# EAGLE design RH012.1 (EAGLE 7.1.0)
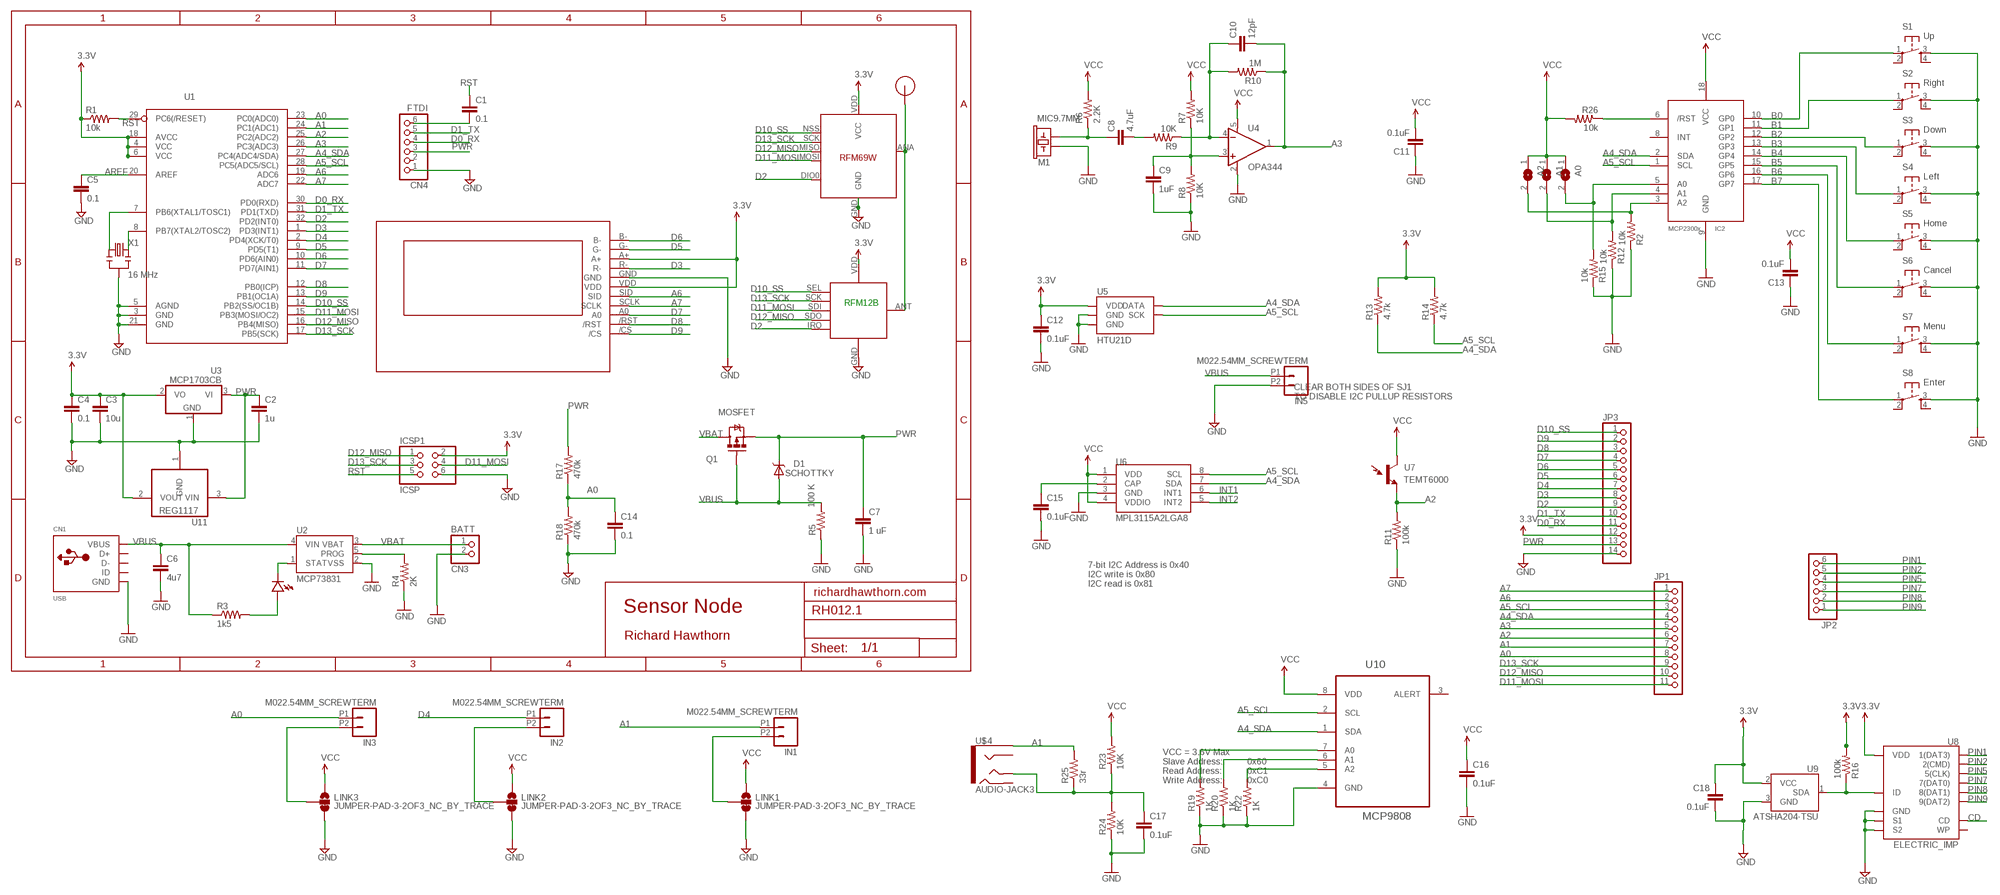
[diagram p0: schematic, sheet 1]

## Parts
A0  SJ  [SJ]
A1  SJ  [SJ]
A2  SJ  [SJ]
C1  0.1  CAP0603-CAP  [0603-CAP]
C2  1u  CAP0603-CAP  [0603-CAP]
C3  10u  CAP0805-CAP  [0805-CAP]
C4  0.1  CAP0603-CAP  [0603-CAP]
C5  0.1  CAP0603-CAP  [0603-CAP]
C6  4u7  CAP0603-CAP  [0603-CAP]
C7  1 uF  CAP0805  [0805]
C8  4.7uF  CAP0805  [0805]
C9  1uF  CAP0805  [0805]
C10  12pF  CAP0805  [0805]
C11  0.1uF  CAP0805  [0805]
C12  0.1uF  CAP0805  [0805]
C13  0.1uF  CAP0805  [0805]
C14  0.1  CAP0603-CAP  [0603-CAP]
C15  0.1uF  CAP0805  [0805]
C16  0.1uF  CAP0603-CAP  [0603-CAP]
C17  0.1uF  CAP0603-CAP  [0603-CAP]
C18  0.1uF  CAP0805  [0805]
CN1  USB  USBMINIB  [USB-MINIB]
CN3  BATT  JST_2PIN-SMT-RA  [JST-PH-2-SMT-RA]
CN4  FTDI  PINHD-1X6  [1X06]
D1  SCHOTTKY  DIODE-SCHOTTKY_  [SMA-DIODE]
IC2  MCP2300X/SO  [SO18W]
ICSP1  ICSP  PINHD-2X3  [2X03]
IN1  M022.54MM_SCREWTERM  [1X02_2.54_SCREWTERM]
IN2  M022.54MM_SCREWTERM  [1X02_2.54_SCREWTERM]
IN3  M022.54MM_SCREWTERM  [1X02_2.54_SCREWTERM]
IN5  M022.54MM_SCREWTERM  [1X02_2.54_SCREWTERM]
JP1  PINHD-1X11  [1X11]
JP2  PINHD-1X6  [1X06]
JP3  PINHD-1X14  [1X14]
LED1  LED0603  [0603-LED]
LINK1  JUMPER-PAD-3-2OF3_NC_BY_TRACE  [PAD-JUMPER-3-2OF3_NC_BY_TRACE_YES_SILK_FULL_BOX]
LINK2  JUMPER-PAD-3-2OF3_NC_BY_TRACE  [PAD-JUMPER-3-2OF3_NC_BY_TRACE_YES_SILK_FULL_BOX]
LINK3  JUMPER-PAD-3-2OF3_NC_BY_TRACE  [PAD-JUMPER-3-2OF3_NC_BY_TRACE_YES_SILK_FULL_BOX]
M1  MIC9.7MM  [MIC-9.7MM]
Q1  MOSFET  MOSFET-PCHANNELSMD  [SOT23-3]
R1  10k  RESISTOR0603-RES  [0603-RES]
R2  10k  R-US_R0805  [R0805]
R3  1k5  RESISTOR0603-RES  [0603-RES]
R4  2K  RESISTOR0603-RES  [0603-RES]
R5  100 K  RESISTOR0805-RES  [0805]
R6  2.2K  RESISTOR0805-RES  [0805]
R7  10K  RESISTOR0805-RES  [0805]
R8  10K  RESISTOR0805-RES  [0805]
R9  10K  RESISTOR0805-RES  [0805]
R10  1M  RESISTOR0805-RES  [0805]
R11  100k  RESISTOR0603-RES  [0603-RES]
R12  10k  R-US_R0805  [R0805]
R13  4.7k  RESISTOR0805-RES  [0805]
R14  4.7k  RESISTOR0805-RES  [0805]
R15  10k  R-US_R0805  [R0805]
R16  100k  RESISTOR0805-RES  [0805]
R17  470k  RESISTOR0603-RES  [0603-RES]
R18  470k  RESISTOR0603-RES  [0603-RES]
R19  1K  RESISTOR0603-RES  [0603-RES]
R20  1K  RESISTOR0603-RES  [0603-RES]
R22  1K  RESISTOR0603-RES  [0603-RES]
R23  10K  RESISTOR0603-RES  [0603-RES]
R24  10K  RESISTOR0603-RES  [0603-RES]
R25  33r  RESISTOR0603-RES  [0603-RES]
R26  10k  R-US_R0805  [R0805]
RF1  RFM12B  RFM12B_MINPADS  [RFM12B-MINPADS]
RF2  RFM69  [RFM69W-MINPADS]
S1  Up  DTS-6  [DTS-6]
S2  Right  DTS-6  [DTS-6]
S3  Down  DTS-6  [DTS-6]
S4  Left  DTS-6  [DTS-6]
S5  Home  DTS-6  [DTS-6]
S6  Cancel  DTS-6  [DTS-6]
S7  Menu  DTS-6  [DTS-6]
S8  Enter  DTS-6  [DTS-6]
U1  ATMega-328  ATMEGA168/328TQFP32  [TQFP32-08]
U2  MCP73831  [SOT23-5]
U3  MCP1703CB  [SOT23]
U4  OPA344  [SOT23-5]
U5  HTU21D  HTU21DSMD  [HTU21D]
U6  MPL3115A2LGA8  [LGA8]
U7  TEMT6000  [TEMT6000-SEN]
U8  ELECTRIC_IMP  [SD_MMC_SOCKET]
U9  ATSHA204-TSU  [SOT23-3]
U10  MCP9808  MCP9808-E/MS  [SOP65P490X110-8N]
U11  REG1117  [SOT223]
U$1  RFM12B_ANTENNA  [RFM12B-ANTENNA]
U$2  ST7565LCD  [ST7565LCD]
U$4  AUDIO-JACK3  [AUDIO-JACK-TRRS-SMD]
X1  16 MHz  RESONATORSMD  [RESONATOR-SMD]

## Nets
3.3V: A0.1 A1.1 A2.1 C3.1 C4.1 C11.2 C12.1 C13.2 C16.1 C18.1 IC2.18(VCC) ICSP1.2 JP3.12 LINK1.1 LINK2.1 LINK3.1 R1.1 R6.2 R7.2 R13.2 R14.2 R16.2 R23.2 R26.2 RF1.VDD RF2.VDD(VCC) U1.4(VCC) U1.6(VCC) U1.18(AVCC) U3.2(VO) U4.5(V+) U5.VDD U6.1(VDD) U6.4(VDDIO) U7.COLLECTOR(C1) U8.4(VDD) U9.2(VCC) U10.8(VDD) U11.2(VOUT) ; supply symbol labelled VCC
A0: C14.1 IN3.P1 JP1.8 R17.1 R18.2 U1.23(PC0(ADC0))
A1: IN1.P1 JP1.7 R25.2 U1.24(PC1(ADC1)) U$4.EARTH
A2: JP1.6 R11.2 U1.25(PC2(ADC2)) U7.EMITTER(E1)
A3: C10.2 JP1.5 R10.1 U1.26(PC3(ADC3)) U4.1(OUT)
A4_SDA: IC2.2(SDA) JP1.4 R13.1 U1.27(PC4(ADC4/SDA)) U5.DATA U6.7(SDA) U10.1(SDA)
A5_SCL: IC2.1(SCL) JP1.3 R14.1 U1.28(PC5(ADC5/SCL)) U5.SCK U6.8(SCL) U10.2(SCL)
A6: JP1.2 U1.19(ADC6) U$2.SID
A7: JP1.1 U1.22(ADC7) U$2.SCLK
AREF: C5.1 U1.20(AREF)
B0: IC2.10(GP0) S1.1
B1: IC2.11(GP1) S2.1
B2: IC2.12(GP2) S3.1
B3: IC2.13(GP3) S4.1
B4: IC2.14(GP4) S5.1
B5: IC2.15(GP5) S6.1
B6: IC2.16(GP6) S7.1
B7: IC2.17(GP7) S8.1
CD: U8.CD
D0_RX: CN4.4 JP3.11 U1.30(PD0(RXD))
D1_TX: CN4.5 JP3.10 U1.31(PD1(TXD))
D2: JP3.9 RF1.IRQ RF2.DIO0 U1.32(PD2(INT0))
D3: JP3.8 U1.1(PD3(INT1)) U$2.R-
D4: IN2.P1 JP3.7 U1.2(PD4(XCK/T0))
D5: JP3.6 U1.9(PD5(T1)) U$2.G-
D6: JP3.5 U1.10(PD6(AIN0)) U$2.B-
D7: JP3.4 U1.11(PD7(AIN1)) U$2.A0
D8: JP3.3 U1.12(PB0(ICP)) U$2./RST
D9: JP3.2 U1.13(PB1(OC1A)) U$2./CS
D10_SS: JP3.1 RF1.SEL RF2.NSS(SEL) U1.14(PB2(SS/OC1B))
D11_MOSI: ICSP1.4 JP1.11 RF1.SDI(SDI/MOSI) RF2.MOSI U1.15(PB3(MOSI/OC2))
D12_MISO: ICSP1.1 JP1.10 RF1.SDO(SDO/MISO) RF2.MISO U1.16(PB4(MISO))
D13_SCK: ICSP1.3 JP1.9 RF1.SCK RF2.SCK U1.17(PB5(SCK))
GND [power]: C2.2 C3.2 C4.2 C5.2 C6.2 C7.2 C9.2 C11.1 C12.2 C13.1 C14.2 C15.2 C16.2 C17.2 C18.2 CN1.GND CN3.2 CN4.1 IC2.9(GND) ICSP1.6 IN5.P2 JP3.14 LINK1.3 LINK2.3 LINK3.3 M1.2 R2.1 R4.1 R5.1 R8.1 R11.1 R12.1 R15.1 R18.1 R19.1 R20.1 R22.1 R24.1 RF1.GND RF2.GND S1.3 S2.3 S3.3 S4.3 S5.3 S6.3 S7.3 S8.3 U1.3(GND) U1.5(AGND) U1.21(GND) U2.2(VSS) U3.1(GND) U4.2(V-) U5.7(GND) U5.GND U6.3(GND) U8.3(GND) U8.S1 U8.S2 U9.3(GND) U10.4(GND) U11.1(GND) U$2.GND X1.2
ID: R16.1 U8.6(ID) U9.1(SDA)
INT1: U6.6(INT1)
INT2: U6.5(INT2)
N$1: U1.7(PB6(XTAL1/TOSC1)) X1.1
N$2: A0.2 IC2.5(A0) R15.2
N$3: RF1.ANT RF2.ANA(ANT) U$1.P$1
N$4: LED1.PLUS R3.2
N$5: C8.1 M1.1 R6.1
N$6: C10.1 R9.1 R10.2 U4.4(-IN)
N$7: C8.2 R9.2
N$8: C9.1 R7.1 R8.2 U4.3(+IN)
N$9: C15.1 U6.2(CAP)
N$10: A1.2 IC2.4(A1) R12.2
N$11: A2.2 IC2.3(A2) R2.2
N$12: IC2.6(/RST) R26.1
N$13 [power]: IN1.P2 LINK1.2
N$14: C17.1 R23.1 R24.2 R25.1 U$4.TIP
N$15 [power]: IN2.P2 LINK2.2
N$16: R22.2 U10.5(A2)
N$17: R20.2 U10.6(A1)
N$18: R19.2 U10.7(A0)
N$19 [power]: IN3.P2 LINK3.2
N$20: C1.2 CN4.6
N$21: U1.8(PB7(XTAL2/TOSC2)) X1.3
PIN1: JP2.6 U8.1(1(DAT3))
PIN2: JP2.5 U8.2(2(CMD))
PIN5: JP2.4 U8.5(5(CLK))
PIN7: JP2.3 U8.7(7(DAT0))
PIN8: JP2.2 U8.8(8(DAT1))
PIN9: JP2.1 U8.9(9(DAT2))
PROG: R4.2 U2.5(PROG)
PWR [power]: C2.1 C7.1 CN4.3 D1.C JP3.13 Q1.2(S) R17.2 U3.3(VI) U11.3(VIN)
RST: C1.1 ICSP1.5 R1.2 U1.29(PC6(/RESET))
STAT: LED1.MINUS U2.1(STAT)
VBAT: CN3.1 Q1.3(D) U2.3(VBAT)
VBUS [power]: C6.1 CN1.VBUS D1.A IN5.P1 Q1.1(G) R3.1 R5.2 U2.4(VIN)
VCC: U$2.A+ U$2.VDD ; supply symbol labelled 3.3V
Unconnected: CN1.D+ CN1.D- CN1.ID CN4.2 IC2.8(INT) S1.2 S1.4 S2.2 S2.4 S3.2 S3.4 S4.2 S4.4 S5.2 S5.4 S6.2 S6.4 S7.2 S7.4 S8.2 S8.4 U8.WP U10.3(ALERT) U$4.RING1 U$4.RING2

## Notes on the sheet
- RFM12B
- CLEAR BOTH SIDES OF SJ1
- TO DISABLE I2C PULLUP RESISTORS
- 7-bit I2C Address is 0x40
- I2C write is 0x80
- I2C read is 0x81
- richardhawthorn.com
- Sensor Node
- Richard Hawthorn
- VCC = 3.6V Max
- Slave Address: | 0x60
- Read Address: | 0xC1
- Write Address: | 0xC0

## Library data of the parts
A0 A1 A2 = jumper:SJ: SMD solder JUMPER
C1-C5 C14 = LowPowerLab:CAP: Capacitor Standard 0603 ceramic capacitor, and 0.1" leaded capacitor.
C6 C8-C13 C15-C17 = SparkFun:CAP: Capacitor Standard 0603 ceramic capacitor, and 0.1" leaded capacitor.
C7 = SparkFun-Capacitors:CAP: Capacitor Standard 0603 ceramic capacitor, and 0.1" leaded capacitor.
C18 = SparkFun-Passives:CAP: Capacitor Standard 0603 ceramic capacitor, and 0.1" leaded capacitor.
CN1 = LowPowerLab:USB: USB Connectors USBMINIB - Surface Mount Female Mini-B USB Connector 4UConnector: 06564 By microbuilder.eu Thru-hole RA Female Mini-B USB Connector 4UConnector: 18732 By ladyada.net
CN3 = adafruit:JST_2PIN: JST 2-Pin Connectors of various flavors SMT-RA (S2B-PH-SM4) 4UConnector #17311 SMT (B2B-PH-SM4) THM-RA (S2B-PH) THM (B2B-PH)
CN4 JP2 = pinhead:PINHD-1X6: PIN HEADER
D1 = SparkFun-DiscreteSemi:DIODE-SCHOTTKY: Commonly MBRA140.
IC2 = adafruit:MCP2300X: MCP23008 Inexpensive i2c i/o expander - 8 general purpose i/o pins with optional pullups
ICSP1 = pinhead:PINHD-2X3: PIN HEADER
IN1-IN3 IN5 = SparkFun-Connectors:M02: Standard 2-pin 0.1" header. Use with - straight break away headers ( PRT-00116) - right angle break away headers (PRT-00553) - swiss pins (PRT-00743) - machine pins (PRT-00117) - female headers (PRT-00115) Molex polarized connector foot print use with: PRT-08233 with associated crimp pins and housings. 2.54_SCREWTERM for use with PRT-10571. 3.5mm Screw Terminal footprints for PRT-08084 5mm Screw Terminal footprints for use with PRT-08432
JP1 = pinhead:PINHD-1X11: PIN HEADER
JP3 = pinhead:PINHD-1X14: PIN HEADER
LED1 = LowPowerLab:LED
LINK1-LINK3 = SparkFun-Passives:JUMPER-PAD-3-2OF3_NC_BY_TRACE
M1 = SparkFun:MIC: Microphone Omni-directional electret microphone. 9.7mm standard diameter.
Q1 = SparkFun-DiscreteSemi:MOSFET-PCHANNEL: Generic PMOSFET
R1 R3 R4 R17 R18 = LowPowerLab:RESISTOR: Resistor Basic schematic elements and footprints for 0603, 1206, and PTH resistors.
R2 R12 R15 R26 = adafruit:R-US_: RESISTOR, American symbol
R5 = SparkFun-Resistors:RESISTOR: Resistor Basic schematic elements and footprints for 0603, 1206, and PTH resistors.
R6-R11 R13 R14 R19 R20 R22-R25 = SparkFun:RESISTOR: Resistor Basic schematic elements and footprints for 0603, 1206, and PTH resistors.
R16 = SparkFun-Passives:RESISTOR: Resistor Basic schematic elements and footprints for 0603, 1206, and PTH resistors.
RF1 = LowPowerLab:RFM12B_MINPADS
RF2 = LowPowerLab:RFM69
S1-S8 = switch-tact:DTS-6
U1 = LowPowerLab:ATMEGA168/328: Atmel 32-pin 8-bit micro, 16k flash.
U2 = SparkFun:MCP73831: Microchip's MCP73831 Miniature single cell, fully integrated Li-Ion, Li-polymer charge management controller http://ww1.microchip.com/downloads/en/DeviceDoc/21984a.pdf
U3 = linear:MCP1703: 250 mA, 16V, Low Quiescent Current LDO Regulator Source: http://ww1.microchip.com/downloads/en/DeviceDoc/22049b.pdf
U4 = SparkFun:OPA344
U5 = SparkFun-Sensors:HTU21D
U6 = SparkFun-Sensors:MPL3115A2: Altimeter/Pressure Sensor, I2C, 1.95V-3.6V supply, 50 to 110kPa
U7 = SparkFun:TEMT6000: Ambient Light Sensor Simple light detection sensor. Output varies with light intensity input. Spark Fun Electronics SKU : COM-08348
U8 = SparkFun-RF:ELECTRIC_IMP
U9 = SparkFun-DigitalIC:ATSHA204
U10 = Richard1:MCP9808-E/MS: Digital Temperature Sensor,MSOP-8; MPN: MCP9808-E/MS; OC_FARNELL: 2080523; OC_NEWARK: 89T8871; PACKAGE: MSOP-8; SUPPLIER: MICROCHIP
U11 = burr-brown:REG1117: 800mA and 1A Low Dropout (LDO) Positive Regulator 1.8V, 2.5V, 2.85V, 3.3V, 5V, and Adj; MPN: REG1117; OC_FARNELL: 1097566; OC_NEWARK: 14P6981
U$1 = LowPowerLab:RFM12B_ANTENNA
U$2 = Richards:ST7565LCD
U$4 = SparkFun-Connectors:AUDIO-JACK3: Audio jack - 3.5mm TRRS variety - two rings.
X1 = SparkFun:RESONATOR: Resonator Small SMD resonator. This is the itty bitty 10/20MHz resonators with built in caps. CSTCE10M0G55 and CSTCE20M0V53. Footprint has been reviewed closely but hasn't been tested yet.

## Net classes
1 power: width 0.381 mm, clearance 0.254 mm

## Board
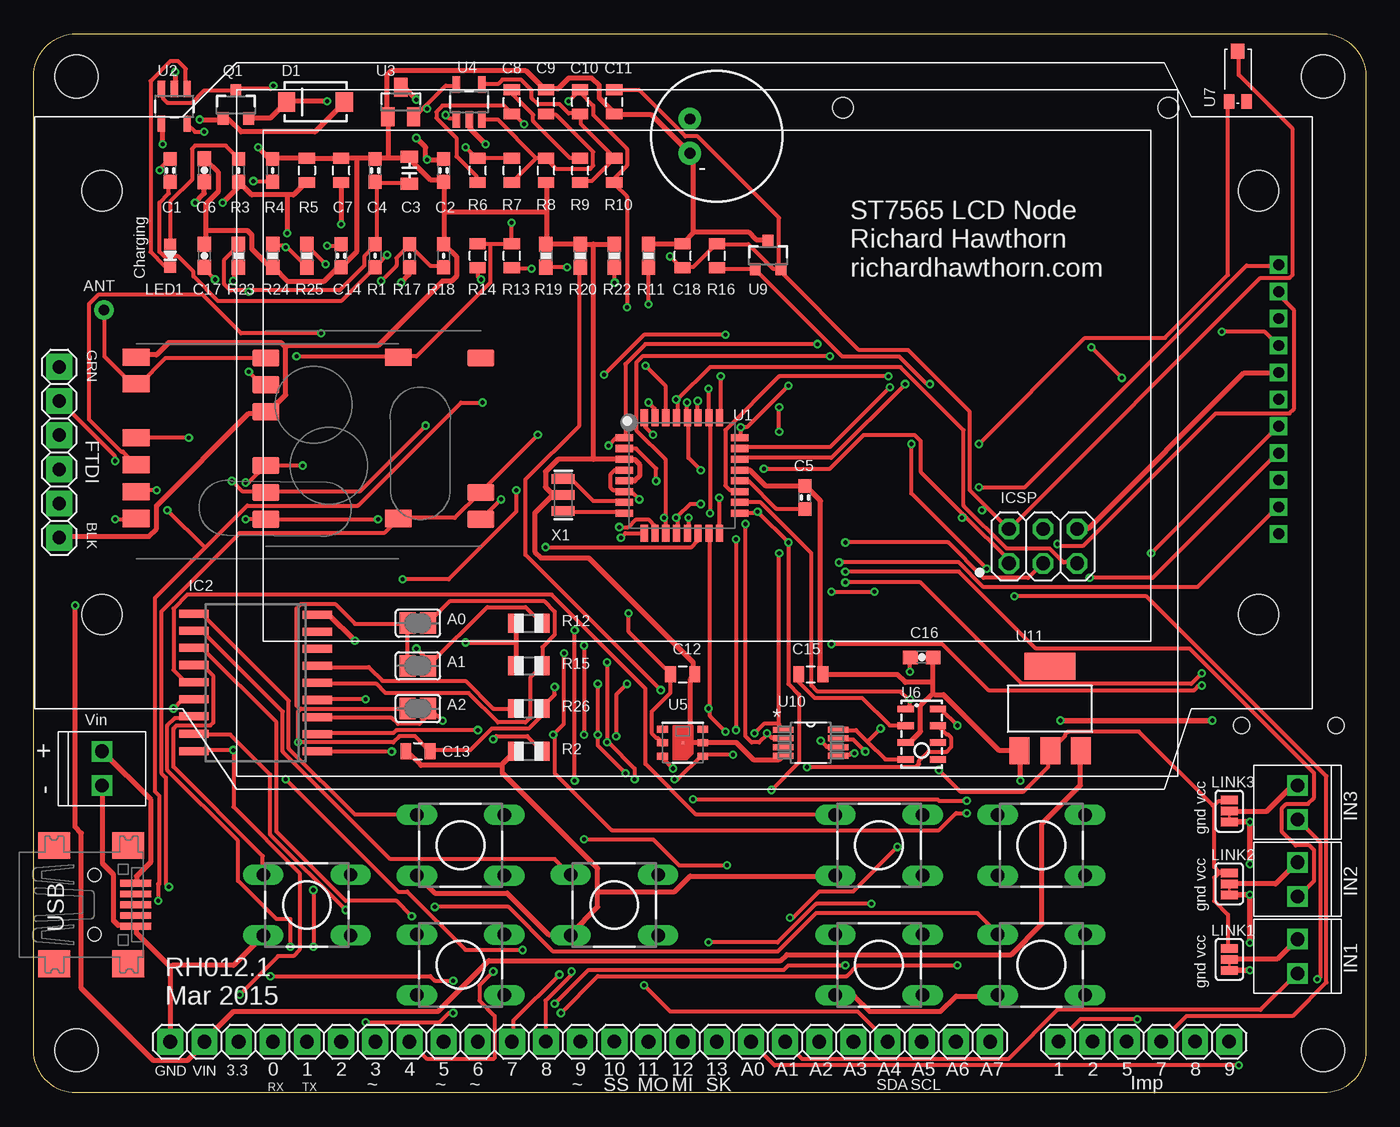
[diagram p1: board, top side]
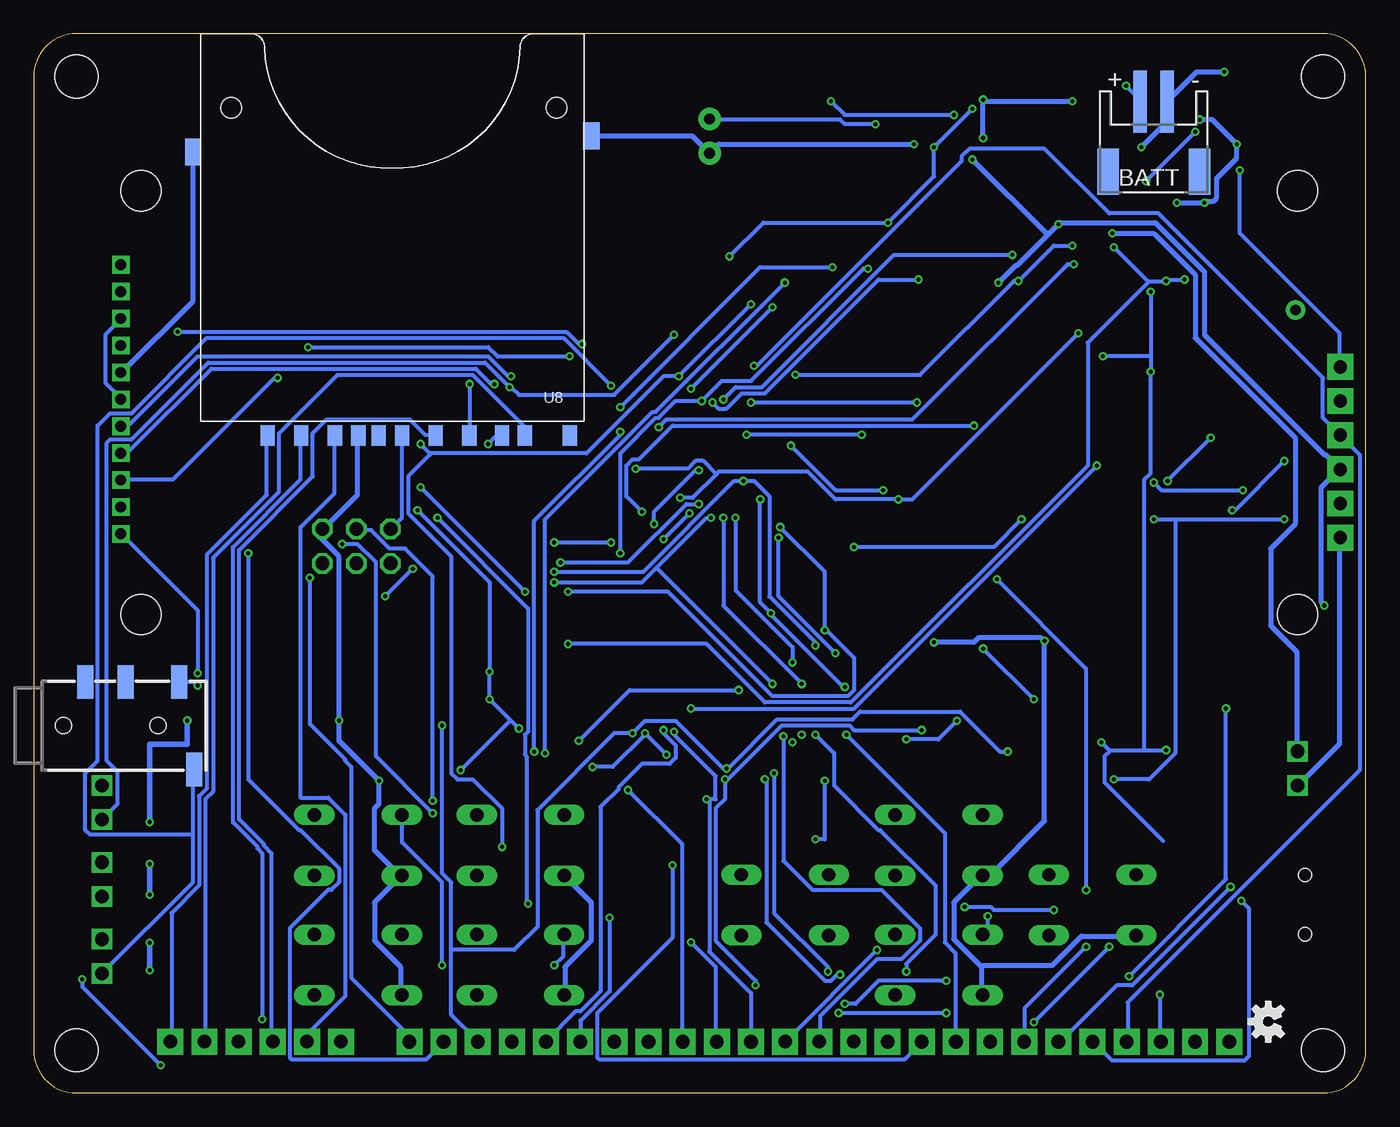
[diagram p2: board, bottom side, seen from below]

Size 99.06 x 78.74 mm. Coordinates in mm from the lower left corner, seen from the top.
Outline: 0,3.17 0,75.56 arc-90 3.17,78.74 95.89,78.74 arc-90 99.06,75.56 99.06,3.17 arc-90 95.89,0 3.17,0 arc-90 0,3.17
Copper layers (1*16): Top 0.035mm / dielectric 1.5mm / Bottom 0.035mm
Design rules "ITEADstudio_DRC *": minimum track width 12mil, minimum drill 12mil, track to track 6mil, track to pad 6mil, pad to pad 6mil, via to via 6mil, smd to smd 0mil, copper to edge 10mil, drill to drill 10mil, minimum pad ring 10mil, minimum via ring 6mil, stop-mask expansion 2mil, vias tented up to drill 100mil, thermal gap 15mil
Holes 3.2 mm at 3.17,3.17 95.89,3.17 3.17,75.56 95.89,75.56
tRestrict: area 24.3,8.9 to 29.1,12.8; area 5.8,16.9 to 6.9,18.5; area 5.2,9.7 to 6.7,10.4
bRestrict: area 27.4,17.7 to 29.2,18.7; area 21.1,13.8 to 22.9,14.9; area 21.6,12.6 to 22.1,13.2; area 20.7,12.6 to 21.2,13.2; area 20.2,12.8 to 20.7,13.5; area 20.1,13.4 to 20.6,14; area 26.5,18.9 to 27.1,19.5; area 26.5,17.9 to 27.1,18.5; area 27.5,19.1 to 28,19.8; area 27.9,18.8 to 29.1,19.6

### Footprints (pad centres in the part's own frame; a part is rotated, then mirrored left to right if it is on the bottom)
SJ = smd 1.168 x 1.6: 1 -0.762,0; 2 0.762,0
0603-CAP = smd 1.016 x 0.965: 1 -0.85,0; 2 0.85,0
0805-CAP = smd 0.902 x 1.3: 1 -1,0; 2 1,0
0603-CAP' = smd 1.1 x 1: 1 -0.85,0; 2 0.85,0
0805 = smd 0.8 x 1.2: 1 -0.9,0; 2 0.9,0
USB-MINIB = smd 0.5 x 2.308: D+ 0,4.064; D- -0.8,4.064; GND 1.6,4.064; ID 0.8,4.064; VBUS -1.6,4.064 | smd 2 x 2.4: GND1 -4.4,-2; GND2 -4.4,3.5; GND3 4.4,3.5; GND4 4.4,-2 | hole 1: -2.2,1; 2.2,1
JST-PH-2-SMT-RA = smd 1 x 4.6: 1 1,-3.7; 2 -1,-3.7 | smd 1.6 x 3.4: NC1 -3.4,1.5; NC2 3.4,1.5
1X06 = drill 1 pad 1.93 square: 1 -6.35,0; 2 -3.81,0; 3 -1.27,0; 4 1.27,0; 5 3.81,0; 6 6.35,0
SMA-DIODE = smd 1.27 x 1.47: A -2.15,0; C 2.15,0
SO18W = smd 0.6 x 2.2: 1 -4.445,-4.6; 2 -3.175,-4.6; 3 -1.905,-4.6; 4 -0.635,-4.6; 5 0.635,-4.6; 6 1.905,-4.6; 7 3.175,-4.6; 8 4.445,-4.6; 9 5.715,-4.6; 10 5.775,4.6; 11 4.505,4.6; 12 3.235,4.6; 13 1.965,4.6; 14 0.695,4.6; 15 -0.575,4.6; 16 -1.845,4.6; 17 -3.145,4.6; 18 -4.445,4.6
2X03 = drill 1.016 octagon: 1 -2.54,-1.27; 2 -2.54,1.27; 3 0,-1.27; 4 0,1.27; 5 2.54,-1.27; 6 2.54,1.27
1X02_2.54_SCREWTERM = drill 1.016 square: P1 2.54,0; P2 0,0
1X11 = drill 1.016 pad 1.93 square: 1 -12.7,0; 2 -10.16,0; 3 -7.62,0; 4 -5.08,0; 5 -2.54,0; 6 0,0; 7 2.54,0; 8 5.08,0; 9 7.62,0; 10 10.16,0; 11 12.7,0
1X14 = drill 1 pad 1.93 square: 1 -16.51,0; 2 -13.97,0; 3 -11.43,0 | drill 1.016 pad 1.93 square: 4 -8.89,0; 5 -6.35,0; 6 -3.81,0; 7 -1.27,0; 8 1.27,0; 9 3.81,0; 10 6.35,0; 11 8.89,0; 12 11.43,0; 13 13.97,0; 14 16.51,0
0603-LED = smd 0.8 x 0.9: MINUS -0.85,0; PLUS 0.85,0
PAD-JUMPER-3-2OF3_NC_BY_TRACE_YES_SILK_FULL_BOX = smd 0.635 x 1.27: 1 -0.813,0; 2 0,0; 3 0.813,0
MIC-9.7MM = drill 0.8 pad 1.676: 1 -2,1.27; 2 -2,-1.27
SOT23-3 = smd 0.8 x 0.9: 1 -0.95,-1; 2 0.95,-1; 3 0,1.1
0603-RES = smd 1.016 x 0.965: 1 -0.85,0; 2 0.85,0
R0805 = smd 1.1 x 1.4: 1 -1,0; 2 1,0
0603-RES' = smd 1.1 x 1: 1 -0.85,0; 2 0.85,0
RFM12B-MINPADS = smd 2 x 1.27: ANT 8,-6; GND 8,-2; IRQ -8,4; SCK 8,4; SDI 8,2; SDI1 -8.002,-6.001; SDO -8,6; SEL 8,6; VDD 8,-4
RFM69W-MINPADS = smd 2 x 1.27: ANA 8,-5; DIO0 -11.5,5; GND 8,-7; MISO 8,1; MOSI 8,3; NSS 8,5; SCK 8,-1; VDD -11.5,-7
DTS-6 = drill 1 long: 1 -3.25,2.25; 2 3.25,2.25; 3 -3.25,-2.25; 4 3.25,-2.25
TQFP32-08 = smd 1.27 x 0.533: 1 -4.293,2.8; 2 -4.293,2; 3 -4.293,1.2; 4 -4.293,0.4; 5 -4.293,-0.4; 6 -4.293,-1.2; 7 -4.293,-2; 8 -4.293,-2.8; 17 4.293,-2.8; 18 4.293,-2; 19 4.293,-1.2; 20 4.293,-0.4; 21 4.293,0.4; 22 4.293,1.2; 23 4.293,2; 24 4.293,2.8 | smd 0.533 x 1.27: 9 -2.8,-4.293; 10 -2,-4.293; 11 -1.2,-4.293; 12 -0.4,-4.293; 13 0.4,-4.293; 14 1.2,-4.293; 15 2,-4.293; 16 2.8,-4.293; 25 2.8,4.293; 26 2,4.293; 27 1.2,4.293; 28 0.4,4.293; 29 -0.4,4.293; 30 -1.2,4.293; 31 -2,4.293; 32 -2.8,4.293
SOT23-5 = smd 0.55 x 1.2: 1 -0.95,-1.3; 2 0,-1.3; 3 0.95,-1.3; 4 0.95,1.3; 5 -0.95,1.3
SOT23 = smd 1 x 1.4: 1 -0.95,-1.1; 2 0.95,-1.1; 3 0,1.1
HTU21D = smd 0.2 x 0.2: 7 0,0 | smd 0.8 x 0.5: DATA 1.5,-1; GND 1.5,0; NC@1 -1.5,1; NC@6 1.5,1; SCK -1.5,-1; VDD -1.5,0
LGA8 = smd 1.2 x 0.5: 1 -1.2,1.875; 2 -1.2,0.625; 3 -1.2,-0.625; 4 -1.2,-1.875; 5 1.2,-1.875; 6 1.2,-0.625; 7 1.2,0.625; 8 1.2,1.875
TEMT6000-SEN = smd 1.1 x 0.8: BASE -1.87,-0.65; EMITTER -1.87,0.65 | smd 1.1 x 1: COLLECTOR 1.86,0.01
SD_MMC_SOCKET = smd 1.05 x 1.56: 1 6.77,29.87; 2 4.27,29.87; 3 2.52,29.87; 4 -0.73,29.87; 5 -3.23,29.87; 6 -5.73,29.87; 7 -8.15,29.87; 8 -9.85,29.87; 9 9.27,29.87; CD 1.02,29.87; WP -13.2,29.87 | smd 1.2 x 2: S1 -14.8,7.6; S2 14.8,8.8 | hole 1.55: 11.98,5.5; -12.22,5.5
SOP65P490X110-8N = smd 1.524 x 0.457: 1 -2.032,0.965; 2 -2.032,0.33; 3 -2.032,-0.33; 4 -2.032,-0.965; 5 2.032,-0.965; 6 2.032,-0.33; 7 2.032,0.33; 8 2.032,0.965
SOT223 = smd 1.499 x 2.007: 1 -2.261,-3.15; 2 0.025,-3.15; 3 2.311,-3.15 | smd 3.81 x 2.007: 4 0,3.15
RFM12B-ANTENNA = drill 0.8 pad 1.422: P$1 0,0
ST7565LCD = drill 0.8 square: /CS 87.5,6; /RST 87.5,8; A0 87.5,10; A+ 87.5,22; B- 87.5,26; G- 87.5,24; GND 87.5,18; R- 87.5,20; SCLK 87.5,12; SID 87.5,14; VDD 87.5,16 | hole 3: 0,0; 86,0; 86,31.5; 0,31.5
AUDIO-JACK-TRRS-SMD = smd 1.2 x 2.5: EARTH 11.3,-3.25; RING1 6.2,3.25; RING2 3.2,3.25; TIP 10.2,3.25 | hole 1.2: 1.6,0; 8.6,0
RESONATOR-SMD = smd 0.7 x 1.7: 1 -1.2,0; 2 0,0; 3 1.2,0

### Placement (x,y rotation side)
A0  28.57,34.92 0 top
A1  28.57,31.75 0 top
A2  28.57,28.57 0 top
C1  10.16,68.58 90 top
C2  30.48,68.58 270 top
C3  27.94,68.58 90 top
C4  25.4,68.58 90 top
C5  57.35,44.27 90 top
C6  4u7  [0603-CAP']  12.7,68.58 90 top
C7  22.86,68.58 90 top
C8  35.56,73.66 90 top
C9  38.1,73.66 90 top
C10  40.64,73.66 90 top
C11  43.18,73.66 90 top
C12  48.26,31.11 0 top
C13  28.57,25.4 0 top
C14  22.86,62.23 270 top
C15  57.78,31.11 0 top
C16  0.1uF  [0603-CAP']  66.04,32.38 0 top
C17  0.1uF  [0603-CAP']  12.7,62.23 90 top
C18  48.26,62.23 90 top
CN1  3.53,14 270 top
CN3  15.78,69.97 180 bottom
CN4  1.91,47.62 90 top
D1  20.95,73.66 180 top
IC2  16.51,29.84 90 top
ICSP1  75.06,40.64 0 top
IN1  93.98,11.43 270 top
IN2  93.98,17.14 270 top
IN3  93.98,22.86 270 top
IN5  5.08,22.86 90 top
JP1  58.42,3.81 180 top
JP2  82.55,3.81 180 top
JP3  26.67,3.81 180 top
LED1  10.16,62.23 90 top
LINK1  88.9,9.93 270 top
LINK2  88.9,15.54 270 top
LINK3  88.9,20.95 270 top
M1  50.8,71.12 0 top
Q1  15.04,73.43 0 top
R1  25.4,62.23 270 top
R2  36.83,25.4 0 top
R3  15.24,68.58 90 top
R4  17.78,68.58 270 top
R5  20.32,68.58 270 top
R6  33.02,68.58 90 top
R7  35.56,68.58 90 top
R8  38.1,68.58 90 top
R9  40.64,68.58 90 top
R10  43.18,68.58 90 top
R11  100k  [0603-RES']  45.72,62.23 270 top
R12  36.83,34.92 0 top
R13  35.56,62.23 90 top
R14  33.02,62.23 90 top
R15  36.83,31.75 0 top
R16  50.8,62.23 90 top
R17  27.94,62.23 270 top
R18  30.48,62.23 270 top
R19  1K  [0603-RES']  38.1,62.23 270 top
R20  1K  [0603-RES']  40.64,62.23 270 top
R22  1K  [0603-RES']  43.18,62.23 270 top
R23  10K  [0603-RES']  15.24,62.23 90 top
R24  10K  [0603-RES']  17.78,62.23 90 top
R25  33r  [0603-RES']  20.32,62.23 90 top
R26  36.83,28.57 0 top
RF1  25.26,48.64 180 top
RF2  15.62,47.7 180 top
S1  31.75,18.41 0 top
S2  43.18,13.97 0 top
S3  31.75,9.53 0 top
S4  20.32,13.97 0 top
S5  62.87,18.41 0 top
S6  62.87,9.53 0 top
S7  74.93,18.41 0 top
S8  74.93,9.53 0 top
U1  48.21,45.9 0 top
U2  10.46,73.33 180 top
U3  27.3,73.66 0 top
U4  32.38,73.66 0 top
U5  48.26,26.04 0 top
U6  66.04,26.67 0 top
U7  89.53,75.56 90 top
U8  72.39,78.74 180 bottom
U9  54.61,62.23 0 top
U10  57.78,26.04 0 top
U11  75.56,28.57 0 top
U$1  5.23,58.2 0 top
U$2  5.08,35.56 0 top
U$3  [OSHW-LOGO-S]  7.26,5.31 90 bottom
U$4  98.42,27.3 0 bottom
X1  39.37,44.45 270 top

### Tracks (layer width: path | path; a pad name or v marks a point on that pad's centre or on a via)
3.3V  (via drill 0.3)
  Top 0.305: R7.2 35.55,69.49 33.03,69.49 R6.2 32.92,69.49 v32.12,70.29 | 29.09,73.32 28.35,72.58 U3.2 | 29.09,73.32 30.63,74.87 31.43,74.87 U4.5 | 29.09,73.32 v29.26,73.15 | 27.2,54.75 RF2.VDD | 33.95,63.09 35.55,63.09 R13.2 35.55,63.21 v35.55,64.69 | 33.95,63.09 33.03,63.09 R14.2 | 33.95,63.09 33.95,60.24 28.46,54.75 27.32,54.75 RF2.VDD | 16,59.66 22.75,59.66 24.57,61.49 24.57,62.18 25.38,62.98 R1.1 25.49,63.09 25.49,67.67 C4.1 25.6,67.67 27.89,67.67 C3.1 | 16,59.66 14.63,59.66 14.17,60.12 14.17,61.95 15.2,62.98 R23.2 | v16,53.61 16.92,52.69 17.26,52.69 RF1.VDD | v16,59.55 16,59.66 | U1.4 43.89,46.29 43.2,46.29 42.86,45.95 42.86,45.03 43.09,44.81 43.89,44.81 U1.6 44.01,44.58 44.58,44.58 v45.03,44.12 | U5.VDD 46.75,26.06 46.41,26.4 46.29,26.4 45.95,26.75 45.95,28.35 47.32,29.72 47.32,31.09 C12.1 47.32,31.2 44.23,34.29 v44.23,35.66 | A1.1 27.77,31.77 27.77,34.86 A0.1 27.66,34.86 23.89,34.86 22.4,36.35 19.89,36.35 19.55,36.01 19.55,28.8 19.77,28.57 19.89,28.57 | 19.89,28.57 A2.1 | 19.89,28.57 19.66,28.35 19.66,26.29 | 19.66,26.29 19.89,26.06 26.75,26.06 27.2,26.52 28.35,26.52 29.38,25.49 C13.2 29.49,25.49 32.46,25.49 34.06,27.09 36.8,27.09 37.72,28 37.72,28.57 R26.2 37.83,28.69 38.75,29.6 v38.75,30.18 | IC2.18 12,25.49 v14.86,25.49 14.86,21.26 19.77,16.34 19.77,10.63 19.32,10.17 18.17,10.17 v15.32,7.32 | v19.66,26.06 19.66,26.29 | v19.55,54.75 26.98,54.75 RF2.VDD | 88.12,16.34 87.78,16 87.78,14.29 88.81,13.26 88.81,10.74 LINK1.1 | 88.12,16.34 88.81,16.34 LINK2.1 | 87.78,21.37 88.12,21.72 88.81,21.72 LINK3.1 | 87.78,21.37 87.78,16.8 88.12,16.46 88.12,16.34 | 87.78,21.37 87.67,21.37 82.18,26.86 76.92,26.86 76.69,26.63 76.69,26.52 75.67,25.49 U11.2 75.44,25.38 75.44,24.23 73.61,22.4 68.92,22.4 v67.32,24
  Top 0.305: 62.01,26.12 61.15,26.98 59.89,26.98 U10.8 | 62.01,26.12 63.32,24.8 64.81,24.8 U6.4 | v65.15,31.32 65.15,32.35 C16.1 | U6.1 64.92,28.57 65.15,28.8 v65.15,29.26 65.04,29.26 64.47,29.83 58.29,29.83 57.84,30.29 57.84,40.12 54.06,43.89 52.58,43.89 U1.18 | v62.98,27.09 62.01,26.12 | U9.2 55.55,61.27 54.98,61.27 53.15,63.09 50.86,63.09 R16.2 50.75,63.09 49.03,61.38 48.35,61.38 C18.1 48.12,61.38 v47.32,62.18 | C11.2 43.2,74.52 45.03,74.52 48.46,71.09 49.38,71.09 55.44,65.04 55.44,61.38 U9.2 | U7.COLLECTOR 89.61,77.38 89.61,75.67 93.61,71.67 93.61,60.81 93.38,60.58 91.21,60.58 72.58,41.95 ICSP1.2 72.47,41.95 70.81,43.6 | 70.81,43.6 69.61,44.81 69.61,50.63 65.04,55.21 61.38,55.21 55.66,60.92 55.66,61.15 U9.2 | 70.81,43.6 v70.52,43.32
  Bottom 0.305: v29.26,73.15 v32.12,70.29 32.12,68.12 v35.55,64.69 44.81,64.69 v47.32,62.18 | v16,59.55 16,54.75 | 16,54.75 v16,53.61 16,46.06 16.46,45.61 16.46,25.49 | v45.03,44.12 45.03,36.46 v44.23,35.66 44.23,35.55 38.86,30.18 v38.75,30.18 | 19.09,25.49 16.46,25.49 | 16.46,25.49 v14.86,25.49 | v19.66,26.06 19.09,25.49 | 15.09,18.75 19.43,23.09 19.43,25.03 19.09,25.38 19.09,25.49 | 16,54.75 v19.55,54.75 | 63.61,27.72 v65.15,29.26 v65.15,31.32 65.15,37.95 v70.52,43.32 | 63.61,27.72 v62.98,27.09 | 63.61,27.72 v67.32,24 | U8.4 71.67,48.81 71.67,42.75 72.47,41.95 ICSP1.2 | v15.32,7.32 15.32,3.89 JP3.12
A0  (via drill 0.3)
  Top 0.305: v21.83,62.98 22.86,62.98 C14.1 | v25.83,60.35 26.98,61.49 26.98,62.06 27.89,62.98 R17.1 28,62.98 29.49,61.49 30.4,61.49 R18.2 | v63.66,52.46 59.21,48.01 52.58,48.01 U1.23 | IN3.P1 95.67,18.63 95.67,8.57 95.56,8.57 v95.44,8.46 | v42.41,53.38 45.38,56.35 v51.44,56.35 | JP1.8 55.09,2.06 v89.61,2.06
  Bottom 0.305: v21.83,62.98 23.2,62.98 v25.83,60.35 26.18,60.35 33.15,53.38 v42.41,53.38 | IN3.P1 92.81,21.49 92.81,23.89 93.61,24.69 93.61,48.35 93.38,48.58 91.78,48.58 86.07,54.29 65.49,54.29 v63.66,52.46 63.55,52.46 62.98,51.89 55.89,51.89 v51.44,56.35 | v89.61,2.06 95.44,7.89 v95.44,8.46
A1  (via drill 0.3)
  Top 0.305: v21.72,61.61 20.34,62.98 R25.2 | U1.24 52.58,48.81 v52.58,49.49 53.03,49.49 v56.12,52.58 | 93.95,8.8 IN1.P1 93.84,8.8 91.21,6.17 76.12,6.17 72.47,2.52 57.15,2.52 55.89,3.77 JP1.7
  Bottom 0.305: v21.72,61.61 22.17,61.61 33.72,50.06 52.01,50.06 v52.58,49.49 | 87.21,19.2 87.21,15.66 IN1.P1 | 87.21,19.2 87.21,24 U$4.EARTH | v56.12,52.58 59.66,56.12 86.18,56.12 91.78,50.52 93.38,50.52 94.3,49.61 94.3,24.69 95.21,23.77 95.21,19.55 94.87,19.2 87.21,19.2
A2  (via drill 0.3)
  Top 0.305: v45.72,58.64 R11.2 | v51.09,53.26 51.09,50.29 U1.25 | v70.29,48.23 78.18,56.12 84.12,56.12 88.81,60.81 88.81,73.61 U7.EMITTER | v56.24,13.03 56.46,13.03 58.41,14.97 60.92,14.97 v64.24,18.29
  Bottom 0.305: v45.72,58.64 v51.09,53.26 52.23,53.26 57.95,47.55 69.61,47.55 | 69.61,47.55 v70.29,48.23 | 69.61,47.55 69.61,47.43 71.21,45.83 71.21,43.09 68.01,39.89 68.01,23.77 67.55,23.32 66.41,23.32 64.24,21.14 v64.24,18.29 | v56.24,13.03 56.24,7.54 58.41,5.37 58.41,3.89 JP1.6
A3  (via drill 0.3)
  Top 0.305: v30.63,72.69 30.86,72.47 31.43,72.47 U4.1 | v39.78,73.72 40.58,74.52 C10.2 40.58,74.41 41.6,73.38 41.6,72.69 44.12,70.18 44.12,68.92 43.2,68.01 43.2,67.78 R10.1 43.2,67.55 44.12,66.64 v44.12,58.41 | v50.18,52.35 50.18,50.29 U1.26 50.29,50.06 v50.29,43.09 | v52.23,41.15 v52.23,26.98
  Bottom 0.305: v30.63,72.69 38.75,72.69 v39.78,73.72 | v44.12,58.41 v50.18,52.35 | v52.23,26.98 52.23,26.75 51.32,25.83 51.32,24.92 51.78,24.46 53.84,24.46 55.55,22.75 55.55,22.63 56.92,21.26 56.92,7.54 58.41,6.06 58.75,6.06 60.92,3.89 JP1.5 | v50.29,43.09 v52.23,41.15
A4_SDA  (via drill 0.3)
  Top 0.305: v37.03,61.27 35.66,61.27 R13.1 | v49.38,51.44 49.38,50.29 U1.27 | v52.01,25.15 49.84,25.15 U5.DATA 49.61,25.03 47.89,23.32 v47.66,23.32 | v53.61,26.75 54.29,27.43 55.32,27.43 | U10.1 55.32,27.43 | v57.49,24.23 65.61,24.23 65.84,24.46 65.84,24.69 66.52,25.38 67.89,25.38 68.24,25.72 68.24,26.4 68.01,26.63 67.89,26.63 67.32,27.2 U6.7 | v33.03,26.98 26.98,26.98 26.75,26.75 21.14,26.75 IC2.2 | v55.44,40.12 55.44,27.43 55.32,27.43 | v45.38,8 47.32,6.06 61.27,6.06 63.44,3.89 JP1.4
  Bottom 0.305: v37.03,61.27 37.38,61.27 45.72,52.92 47.89,52.92 v49.38,51.44 51.32,51.44 52.58,50.18 52.81,50.18 55.44,47.55 v55.44,40.12 | v52.01,25.15 v53.61,26.75 53.61,26.63 56.01,24.23 v57.49,24.23 | v33.03,26.98 38.06,26.98 38.41,27.32 43.43,27.32 47.43,23.32 v47.66,23.32 47.66,21.83 48.35,21.14 48.35,11.32 45.38,8.34 v45.38,8
A5_SCL  (via drill 0.3)
  Top 0.305: v68.69,27.32 67.55,28.46 67.32,28.46 U6.8 | v33.26,60.47 33.03,60.69 33.03,61.27 R14.1 | v48.58,51.32 48.58,50.29 U1.28 48.69,50.06 48.69,47.21 v49.61,46.29 | v47.55,24.12 46.86,24.8 46.86,25.03 U5.SCK | U10.2 55.66,26.4 54.86,26.4 v54.52,26.75 54.52,26.63 53.95,26.06 53.38,26.06 52.92,26.52 v52.92,42.29 | v26.63,25.38 21.14,25.38 IC2.1
  Bottom 0.305: v33.26,60.47 36.23,60.47 44.69,52.01 46.41,52.01 47.55,50.86 48.12,50.86 v48.58,51.32 | v26.63,25.38 27.2,25.38 30.18,28.35 37.6,28.35 38.18,27.77 43.78,27.77 47.43,24.12 v47.55,24.12 47.78,24.12 51.32,27.66 53.61,27.66 v54.52,26.75 55.89,26.75 61.61,21.03 61.61,12.34 63.32,10.63 68.01,10.63 | v49.61,46.29 49.84,46.29 52.92,43.2 v52.92,42.29 | v68.69,27.32 68.69,16.34 68.01,15.66 68.01,10.63 | 68.01,10.63 68.01,5.83 66.06,3.89 JP1.3
A6  (via drill 0.3)
  Top 0.305: v63.55,53.26 55.44,53.26 51.44,49.26 51.44,45.15 51.78,44.81 52.46,44.81 U1.19 | v83.1,40.12 92.47,49.49 U$2.SID
  Bottom 0.305: v63.55,53.26 63.78,53.26 65.27,54.75 86.87,54.75 92.01,49.61 92.47,49.61 U$2.SID | v83.1,40.12 83.1,23.32 79.32,19.55 79.21,19.55 76.35,16.69 76.35,15.66 76.92,15.09 77.15,15.09 80.01,12.23 80.01,2.63 79.9,2.52 69.84,2.52 68.58,3.77 JP1.2
A7  (via drill 0.3)
  Top 0.305: v64.81,52.69 59.32,47.21 52.58,47.21 U1.22 | v78.52,38.29 83.21,38.29 92.47,47.55 U$2.SCLK
  Bottom 0.305: v64.81,52.69 65.04,52.69 66.18,53.84 85.84,53.84 92.01,47.66 92.47,47.66 U$2.SCLK | v78.52,38.29 78.52,27.43 75.89,24.8 75.89,24.69 75.44,24.23 75.44,8.57 71.21,4.34 71.21,3.89 JP1.1
AREF
  Top 0.305: C5.1 57.26,43.43 55.21,43.43 53.15,45.49 52.58,45.49 U1.20
B0
  Top 0.305: IC2.10 12,35.55 12.57,35.55 18.97,29.15 18.97,25.6 23.89,20.69 28.46,20.69 S1.1
B1
  Top 0.305: IC2.11 12,34.29 12.57,34.29 18.52,28.35 18.52,25.38 26.52,17.37 38.75,17.37 39.89,16.23 S2.1
B2  (via drill 0.3)
  Top 0.305: v28.12,13.14 26.98,14.29 23.2,14.29 18.06,19.43 18.06,27.55 12.57,33.03 12,33.03 IC2.12
  Bottom 0.305: v28.12,13.14 28.12,12.23 28.46,11.89 S3.1
B3
  Top 0.305: IC2.13 12,31.77 12.57,31.77 13.37,30.98 13.37,27.55 13.14,27.32 10.63,27.32 10.4,27.09 10.4,24.23 17.03,17.6 17.03,16.23 S4.1
B4
  Top 0.305: IC2.14 11.89,30.63 11.2,30.63 10.4,31.43 10.4,36.01 11.43,37.03 38.52,37.03 45.49,30.06 45.49,24.46 49.26,20.69 59.55,20.69 S5.1
B5  (via drill 0.3)
  Top 0.305: v10.4,28.57 11.09,29.26 11.89,29.26 IC2.15 | 59.55,11.77 S6.1 | v60.35,9.49 56.12,9.49 55.78,9.14 41.26,9.14 v38.75,6.63 | v31.2,8.34 29.83,8.34 29.49,8.69 v17.6,8.69
  Bottom 0.305: v10.4,28.57 10.4,15.89 v17.6,8.69 | v60.35,9.49 59.66,10.17 59.66,11.77 S6.1 | v38.75,6.63 37.95,6.63 36.23,8.34 v31.2,8.34
B6  (via drill 0.3)
  Top 0.305: IC2.16 11.89,27.89 10.52,27.89 9.94,27.32 9.94,24 15.2,18.75 15.2,15.77 18.06,12.92 19.09,12.92 v19.09,10.86 | v68.69,9.49 61.27,9.49 60.47,8.69 41.95,8.69 v39.2,5.94 | v31.2,5.94 30.86,5.94 30.18,5.26 v24.69,5.26
  Bottom 0.305: v68.69,9.49 68.69,15.66 71.67,18.63 71.67,20.57 S7.1 | v31.2,5.94 v39.2,5.94 | v19.09,10.86 v24.69,5.26
B7  (via drill 0.3)
  Top 0.305: v23.2,13.6 17.6,19.2 17.6,23.66 14.63,26.63 12,26.63 IC2.17 | v29.83,13.83 35.32,13.83 38.63,10.52 55.32,10.52 58.18,13.37 70.18,13.37 71.67,11.89 S8.1
  Bottom 0.305: v23.2,13.6 27.66,13.6 27.89,13.83 v29.83,13.83
D0_RX  (via drill 0.3)
  Top 0.305: v45.49,54.06 46.98,52.58 46.98,50.29 U1.30 | 1.83,48.81 CN4.4
  Bottom 0.305: v45.49,54.06 45.26,54.06 30.06,69.27 30.06,69.61 29.49,70.18 23.89,70.18 19.09,65.38 15.43,65.38 3.2,53.15 3.2,50.18 1.94,48.92 CN4.4 1.83,48.81 0.46,47.43 0.46,24 17.72,6.74 17.72,3.89 JP3.11
D1_TX  (via drill 0.3)
  Top 0.305: v45.72,51.32 46.18,50.86 46.18,50.29 U1.31 | v33.38,51.32 31.77,51.32 24.12,43.66 15.89,43.66 12.74,40.52 | 12.74,40.52 9.03,36.8 9.03,22.4 9.37,22.06 9.37,15.54 9.26,15.54 v9.26,14.29 | v6.06,46.98 6.06,47.32 1.94,51.44 CN4.5 | 12.74,40.52 v9.94,43.32
  Bottom 0.305: v33.38,51.32 v45.72,51.32 | v6.06,46.98 9.72,43.32 v9.94,43.32 | v9.26,14.29 8.69,13.72 8.69,2.74 9.03,2.4 18.86,2.4 20.23,3.77 JP3.10
D2  (via drill 0.3)
  Top 0.305: v46.06,48.92 45.49,49.49 45.49,50.18 U1.32 | v37.49,48.92 33.26,44.69 RF1.IRQ 33.15,44.58 31.32,42.75 27.2,42.75 RF2.DIO0 27.09,42.63 26.06,41.6 15.32,41.6 9.49,35.78 9.49,23.77 9.83,23.43 9.83,15.54 v10.06,15.32
  Bottom 0.305: v37.49,48.92 v46.06,48.92 | v10.06,15.32 17.37,8 18.52,8 22.63,3.89 22.86,3.89 JP3.9
D3  (via drill 0.3)
  Top 0.305: v58.29,55.66 45.49,55.66 44.01,54.18 44.01,48.81 U1.1 43.78,48.69 43.32,48.69 v42.75,48.12 | v88.35,56.58 91.55,56.58 92.47,55.66 U$2.R- | v20.8,15.09 v20.8,10.86 | v27.43,38.18 30.86,38.18 35.89,43.2 v35.89,44.81
  Bottom 0.305: v58.29,55.66 58.52,55.66 59.44,56.58 v88.35,56.58 | v20.8,15.09 20.8,31.55 v27.43,38.18 | v35.89,44.81 39.43,44.81 v42.75,48.12 | v20.8,10.86 25.38,6.29 25.38,3.89 JP3.8
D4  (via drill 0.3)
  Top 0.305: v46.29,45.49 46.29,46.41 44.81,47.89 44.01,47.89 U1.2 | v60.35,38.75 68.81,38.75 74.52,33.03 85.95,33.03 95.21,23.77 95.21,21.95 94.75,21.49 93.15,21.49 92.81,21.14 92.81,19.43 93.84,18.4 94.87,18.4 95.21,18.06 95.21,15.77 94.07,14.63 IN2.P1 | v40.92,33.26 v40.92,26.63 | v34.18,9.03 33.15,8 33.15,6.86 34.29,5.71 34.29,2.63 34.18,2.52 29.26,2.52 28,3.77 JP3.7
  Bottom 0.305: v60.35,38.75 53.72,38.75 46.98,45.49 v46.29,45.49 45.49,45.49 44.35,44.35 44.35,36.92 40.92,33.49 v40.92,33.26 | v40.92,26.63 39.55,25.26 39.55,22.86 36.23,19.55 36.12,19.55 32,15.43 32,11.77 34.18,9.6 v34.18,9.03
D5  (via drill 0.3)
  Top 0.305: U1.9 44.01,41.6 v43.66,41.26 | v39.43,32.69 39.43,27.43 v38.63,26.63 38.75,26.63 38.75,23.77 42.98,19.55 67.32,19.55 68.58,20.8 v69.38,20.8 | v76.12,40.8 76.24,40.69 78.07,40.69 87.9,50.52 93.38,50.52 93.73,50.86 93.73,58.18 92.58,59.32 U$2.G-
  Bottom 0.305: v43.66,41.26 43.66,36.92 v39.43,32.69 | v38.63,26.63 31.32,19.32 31.32,11.2 30.52,10.4 30.52,3.89 JP3.6 | v76.12,40.8 74.98,40.8 73.61,39.43 73.61,25.03 v69.38,20.8
D6  (via drill 0.3)
  Top 0.305: v43.55,42.06 44.23,42.06 44.81,42.63 45.72,42.63 46.18,42.18 46.18,41.6 U1.10 | v40.23,23.2 v40.23,34.4 | v70.29,45.03 73.72,45.03 90.18,61.49 92.47,61.49 U$2.B- | v59.32,37.26 v62.52,37.26 | v51.55,16.92 48.01,16.92 46.06,18.86 v40.92,18.86
  Bottom 0.305: v43.55,42.06 40.23,38.75 v40.23,34.4 40.12,34.4 38.06,32.35 38.06,29.95 38.52,29.49 44.12,29.49 51.89,37.26 v59.32,37.26 | v40.23,23.2 40.23,18.86 v40.92,18.86 | v62.52,37.26 v70.29,45.03 | v51.55,16.92 51.55,11.54 57.15,5.94 57.15,2.63 57.04,2.52 34.29,2.52 33.03,3.77 JP3.5
D7  (via drill 0.3)
  Top 0.305: 46.98,42.75 46.98,47.09 44.81,49.26 44.81,54.29 45.26,54.75 v59.21,54.75 | 46.98,42.75 46.98,41.6 U1.11 | v80.92,53.15 v78.64,55.44 | v42.63,32 v42.63,26.06 42.75,26.06 44.69,24.12 v44.69,23.32 | v46.86,42.75 46.98,42.75 | v39.09,8.8 35.66,5.37 35.66,3.89 JP3.4
  Bottom 0.305: v59.21,54.75 64.58,54.75 65.27,55.44 v78.64,55.44 | v80.92,53.15 81.15,53.15 88.7,45.61 92.47,45.61 U$2.A0 | v42.63,32 42.63,33.15 46.86,37.38 v46.86,42.75 | v39.09,8.8 39.32,8.8 39.78,8.34 40.23,8.34 44.58,12.69 44.58,23.2 v44.69,23.32
D8  (via drill 0.3)
  Top 0.305: 47.89,42.75 47.89,42.86 48.81,43.78 v49.61,43.78 | 47.89,42.75 47.89,41.6 U1.12 | v59.89,39.43 68.81,39.43 70.64,37.6 86.53,37.6 92.47,43.55 U$2./RST | v41.95,30.4 v41.95,26.63 41.95,25.83 v44.01,23.77 | v47.78,42.75 47.89,42.75 | v40.01,9.03 40.01,8.8 38.06,6.86 38.06,3.89 JP3.3
  Bottom 0.305: v49.61,43.78 50.52,43.78 54.86,39.43 v59.89,39.43 | v41.95,30.4 47.78,36.23 v47.78,42.75 | v40.01,9.03 40.01,9.37 44.01,13.37 v44.01,23.77
D9  (via drill 0.3)
  Top 0.305: v48.69,42.75 48.69,41.6 U1.13 | v60.35,37.95 65.95,37.95 73.5,30.4 86.07,30.4 v86.87,31.2 | v43.32,26.52 43.32,29.6 v44.12,30.4
  Bottom 0.305: v48.69,42.75 49.03,42.75 52.75,39.03 | 52.75,39.03 53.84,37.95 v60.35,37.95 | v86.87,31.2 86.87,35.89 92.47,41.49 U$2./CS | 52.75,39.03 v44.12,30.4 | v43.32,26.52 43.32,17.26 41.15,15.09 36.01,15.09 33.15,12.23 33.15,11.32 34.52,9.94 36.35,9.94 40.58,5.71 40.58,3.89 JP3.2
D10_SS  (via drill 0.3)
  Top 0.305: v38.06,40.58 48.92,40.58 49.38,41.03 49.38,41.6 U1.14 | v25.6,42.63 17.37,42.63 RF1.SEL 17.14,42.63 v15.77,42.63 | v6.06,42.63 7.54,42.63 RF2.NSS | v18.75,23.32 27.09,14.97 27.77,14.97 32.12,10.63 v36.35,10.63
  Bottom 0.305: v38.06,40.58 27.66,40.58 v25.6,42.63 | v15.77,42.63 14.17,42.63 | 14.17,42.63 v6.06,42.63 | v18.75,23.32 16.12,23.32 14.17,25.26 14.17,42.63 | v36.35,10.63 43.09,3.89 JP3.1
D11_MOSI  (via drill 0.3)
  Top 0.305: v9.14,44.81 7.66,44.81 RF2.MOSI | v15.77,45.38 16,45.38 RF1.SDI 17.37,46.63 v20,46.63 | 50.29,28.57 50.29,28 v51.44,26.86 | 50.29,28.57 50.29,41.6 U1.15 | v69.38,21.72 67.32,21.72 67.21,21.83 v49.03,21.83 | v50.18,28.57 50.29,28.57
  Bottom 0.305: v9.14,44.81 15.2,44.81 v15.77,45.38 | v51.44,26.86 51.44,26.63 48.35,23.55 48.35,21.83 v49.03,21.83 48.81,21.72 48.81,10.52 45.72,7.43 JP1.11 | v69.38,21.72 69.38,38.41 71.44,40.46 72.58,40.46 73.95,41.83 74.98,41.83 ICSP1.4 | v20,46.63 38.06,28.57 v50.18,28.57
D12_MISO  (via drill 0.3)
  Top 0.305: v50.98,44.23 50.98,41.6 U1.16 | v34.75,44.12 RF1.SDO | v21.37,56.46 15.43,56.46 12.57,59.32 4.8,59.32 4.12,58.64 4.12,50.06 6.51,47.66 6.63,47.66 7.54,46.75 RF2.MISO | 69.21,42.92 65.95,46.18 65.95,48.46 65.49,48.92 61.72,48.92 59.21,46.41 v54.29,46.41 | 69.21,42.92 72.47,39.66 72.47,39.43 ICSP1.1 | 69.21,42.92 v69.04,42.75 | v50.18,11.2 55.32,11.2 58.18,14.06 v62.29,14.06
  Bottom 0.305: v50.98,44.23 50.06,44.23 48.29,46.01 | 48.29,46.01 48.12,46.18 41.49,46.18 39.43,44.12 v34.75,44.12 33.72,44.12 v21.37,56.46 | v54.29,46.41 50.41,46.41 49.84,46.98 49.26,46.98 48.29,46.01 | v69.04,42.75 62.29,36.01 62.29,26.86 62.52,26.63 62.52,25.15 62.41,25.03 62.41,14.06 v62.29,14.06 | v50.18,11.2 48.35,9.37 48.35,3.89 JP1.10
D13_SCK  (via drill 0.3)
  Top 0.305: v11.54,48.69 7.66,48.69 RF2.SCK | v14.74,45.49 15.54,44.69 17.26,44.69 RF1.SCK 17.37,44.69 24.23,44.69 v29.15,49.61 | 53.84,43.09 53.95,43.09 v56.12,40.92 56.12,30.4 56.92,29.6 56.92,24.57 v54.86,22.52 | 53.84,43.09 52.58,43.09 U1.17 | v60.35,40.92 68.01,40.92 70.64,38.29 73.95,38.29 74.98,39.32 ICSP1.3 | v53.84,43.2 53.84,43.09
  Bottom 0.305: v14.74,45.49 v11.54,48.69 | v60.35,40.92 v56.12,40.92 | v54.86,22.52 50.86,18.52 50.86,3.89 JP1.9 | v29.15,49.61 51.55,49.61 54.06,47.09 54.52,47.09 54.98,46.63 54.98,44.35 v53.84,43.2
GND  (via drill 0.3)
  Top 0.381: 48.81,26.06 48.35,26.06 U5.7 | 48.81,26.06 49.72,26.06 U5.GND 49.95,26.06 52.23,26.06 53.52,24.78 55.41,24.78 U10.4 | 48.81,26.06 48.81,30.75 49.15,31.09 C12.2 49.03,31.2 49.03,32 41.26,39.78 37.72,39.78 37.26,40.23 37.26,43.09 38.63,44.46 | U1.5 44.01,45.49 44.69,45.49 45.03,45.83 45.03,46.75 44.69,47.09 44.01,47.09 U1.3 43.78,47.09 41.6,47.09 | 38.63,44.46 39.32,44.46 X1.2 | 38.63,44.46 38.06,45.03 38.06,46.18 38.98,47.09 41.6,47.09 | 41.6,63.09 40.8,63.09 R20.1 40.58,63.09 38.18,63.09 R19.1 38.18,63.21 38.18,65.49 | 41.6,63.09 43.09,63.09 R22.1 | 38.18,65.49 38.18,67.67 R8.1 | 41.6,63.09 41.6,47.09 | 49.15,64.01 53.15,64.01 53.72,63.44 54.52,63.44 U9.3 | 49.15,64.01 48.35,63.21 C18.2 48.12,63.09 45.72,63.09 R11.1 | v33.6,70.52 32.46,71.67 32.46,72.35 U4.2 | 49.15,64.01 49.03,64.12 49.03,69.61 48.92,69.72 M1.2 48.69,69.95 45.95,72.69 43.2,72.69 C11.1 43.09,72.92 42.06,73.95 42.06,74.87 41.49,75.44 39.78,75.44 38.98,74.64 38.18,74.64 C9.2 37.95,74.64 36.58,76.01 26.63,76.01 26.29,75.67 26.29,72.69 U3.1 26.4,72.47 26.4,69.49 | 12.8,64.12 12.8,66.06 13.72,66.98 13.72,68.47 12.8,69.38 C6.2 | 12.8,64.12 12.8,63.09 C17.2 | 12.8,64.12 15.89,64.12 16.23,63.78 16.23,62.75 17.6,61.38 R24.1 17.83,61.38 18.86,60.35 21.6,60.35 22.63,61.38 C14.2 22.97,61.49 24,62.52 24,69.49 | 7.66,54.75 RF2.GND 7.77,54.86 9.14,54.86 10.06,55.78 18.4,55.78 18.75,55.44 | 18.75,55.44 18.75,51.89 17.6,50.75 17.37,50.75 RF1.GND 17.14,50.52 16,50.52 9.14,43.66 9.14,41.95 8.57,41.38 1.94,41.38 CN4.1 | v10.52,75.89 10.52,74.64 U2.2 | 30.52,65.49 30.52,67.67 C2.2 30.4,67.89 29.49,67.89 28,69.38 C3.2 27.89,69.49 26.4,69.49
  Top 0.381: 30.52,65.49 30.52,63.09 R18.1 30.63,62.98 31.43,62.18 31.43,60.69 31.09,60.35 30.4,60.35 25.6,55.55 18.86,55.55 18.75,55.44 | 26.4,69.49 25.49,69.49 C4.2 25.26,69.49 24,69.49 | 24,69.49 22.97,69.49 C7.2 22.86,69.49 20.46,69.49 R5.1 20.23,69.49 17.83,69.49 R4.1 17.6,69.38 v16.69,70.29 | 30.52,65.49 38.18,65.49 | 10.17,9.37 7.66,11.89 7.66,12.34 CN1.GND 7.43,12.46 6.29,12.46 5.94,12.8 5.94,16.23 5.14,17.03 5.14,22.86 IN5.P2 | ICSP1.6 77.61,41.95 78.41,41.95 89.95,53.49 92.47,53.49 U$2.GND | U1.21 52.58,46.29 53.26,46.29 54.41,45.15 57.26,45.15 C5.2 57.49,45.03 58.52,44.01 58.52,31.2 C15.2 58.75,31.09 64.24,31.09 64.81,30.52 66.86,30.52 | 66.86,29.72 66.86,30.52 | 66.86,30.52 66.86,32.35 C16.2 | 66.86,29.72 65.95,28.8 65.95,26.86 65.15,26.06 64.92,26.06 U6.3 | 66.86,29.72 66.98,29.6 67.67,29.6 71.78,25.49 73.27,25.49 U11.1 73.38,25.26 v73.38,23.2 | 34.75,24.35 28.8,24.35 27.77,25.38 C13.1 | 34.75,24.35 35.78,25.38 R2.1 | 35.89,33.49 35.89,34.86 R12.1 | 35.89,33.49 35.89,31.77 R15.1 | v23.89,33.6 21.95,35.55 21.14,35.55 IC2.9 | v32.12,33.49 35.89,33.49 | S1.3 28.57,16.12 29.83,14.86 35.2,14.86 38.29,11.77 39.89,11.77 S2.3 40.01,11.89 41.95,13.83 41.95,14.97 | 41.95,14.97 41.95,16.69 34.86,23.77 34.86,24.23 34.75,24.35 | 41.95,14.97 47.66,14.97 48.81,16.12 59.55,16.12 S5.3 | 10.17,9.37 10.17,3.89 JP3.14 | S8.3 71.67,7.2 68.58,7.2 67.44,6.06 62.18,6.06 61.04,7.2 59.66,7.2 S6.3 | 10.17,9.37 10.29,9.49 14.86,9.49 17.03,11.66 S4.3
  Top 0.406: v76.35,27.69 v87.63,27.69 | LINK3.3 v90.42,20.14 v90.42,17.02 | LINK2.3 v90.42,14.73 v90.42,11.18 | LINK1.3 v90.42,9.12
  Bottom 0.381: v33.6,70.52 48.12,70.52 48.69,69.95 M1.2 48.92,69.95 50.06,71.09 57.49,71.09 U8.S1 | v10.52,75.89 12.57,75.89 14.74,73.72 CN3.2 14.86,73.5 14.86,72.12 v16.69,70.29 | CN4.1 1.94,41.26 1.94,25.95 5.03,22.86 IN5.P2 | U8.3 74.98,48.81 74.98,44.46 77.5,41.95 ICSP1.6 77.61,41.72 77.61,41.15 76.35,39.89 v76.35,27.69 76.35,26.18 v73.38,23.2 73.38,21.49 73.72,21.14 73.72,18.06 71.89,16.23 S7.3 71.78,16.12 73.72,14.17 73.72,11.32 71.78,9.37 71.78,7.32 71.67,7.32 S8.3 | U8.S2 87.21,69.84 87.21,58.86 92.47,53.61 U$2.GND | S6.3 59.55,7.32 59.55,9.37 57.61,11.32 57.61,14.17 59.55,16.12 S5.3 | v32.12,33.49 29.15,33.49 28.8,33.83 24.12,33.83 v23.89,33.6 23.89,20.23 27.89,16.23 28.46,16.23 S1.3 28.57,16.23 30.63,14.17 30.63,11.43 28.57,9.37 | 28.57,9.37 28.57,7.32 S3.3 | 28.57,9.37 28.46,9.49 23.32,9.49 21.14,11.66 17.14,11.66 S4.3 17.03,11.54
  Bottom 0.406: v90.42,20.14 90.42,25.91 87.63,25.91 v87.63,27.69 | v90.42,14.73 v90.42,17.02 | v90.42,9.12 v90.42,11.18
ID  (via drill 0.3)
  Top 0.305: R16.1 50.86,61.27 53.61,61.27 U9.1 53.72,61.15 60.12,54.75 64.35,54.75 66.41,52.69 v66.64,52.69
  Bottom 0.305: v66.64,52.69 66.64,48.92 U8.6
N$1
  Top 0.305: U1.7 43.89,44.01 41.6,44.01 40.01,45.61 39.43,45.61 X1.1
N$2
  Top 0.305: A0.2 29.38,34.98 30.98,36.58 37.95,36.58 38.75,35.78 38.75,34.06 37.83,33.15 37.83,31.77 R15.2 37.72,31.66 36.92,30.86 36.92,27.89 36.58,27.55 34.52,27.55 32.35,29.72 26.18,29.72 25.49,30.4 21.14,30.4 IC2.5
N$3
  Top 0.305: U$1.P$1 5.26,58.18 5.26,54.75 7.2,52.81 7.54,52.81 RF2.ANA 7.77,52.69 7.89,52.69 9.83,54.63 RF1.ANT
N$4
  Top 0.305: LED1.PLUS 10.17,63.09 10.17,66.29 11.77,67.89 11.77,70.18 12,70.41 14.29,70.41 15.2,69.49 R3.2
N$5  (via drill 0.3)
  Top 0.305: R6.1 32.92,67.78 32.92,68.12 31.43,69.61 31.43,70.98 29.95,72.47 29.95,72.92 30.4,73.38 34.98,73.38 35.55,72.81 C8.1 35.66,72.81 v36.46,72.01
  Bottom 0.305: v36.46,72.01 38.75,72.01 39.09,72.35 48.69,72.35 M1.1
N$6
  Top 0.305: R9.1 40.69,67.78 41.49,67.78 43.09,69.38 R10.2 43.09,69.61 40.69,72.01 40.69,72.69 C10.1 40.58,72.81 39.78,72.81 39.09,73.5 37.49,73.5 37.03,73.95 37.03,74.52 36.23,75.32 34.86,75.32 34.52,74.98 33.38,74.98 U4.4
N$7
  Top 0.305: C8.2 35.66,74.52 35.66,74.18 37.15,72.69 37.15,72.24 39.89,69.49 40.58,69.49 R9.2
N$8
  Top 0.305: 37.38,69.49 34.52,72.35 33.38,72.35 U4.3 | 37.38,69.49 38.06,69.49 R8.2 38.18,69.38 38.86,68.69 41.38,68.69 41.6,68.92 41.6,69.95 38.86,72.69 38.18,72.69 C9.1 | 37.38,69.49 35.66,67.78 R7.1
N$9
  Top 0.305: U6.2 64.81,27.32 63.66,27.32 61.61,29.38 58.06,29.38 56.92,30.52 56.92,31.09 C15.1
N$10  (via drill 0.3)
  Top 0.305: R12.2 37.72,34.98 36.58,36.12 33.72,36.12 29.38,31.77 A1.2 29.49,32 v28.46,33.03 | v24.69,29.26 21.14,29.26 IC2.4
  Bottom 0.305: v28.46,33.03 v24.69,29.26
N$11  (via drill 0.3)
  Top 0.305: v34.18,26.29 34.4,26.52 36.69,26.52 37.72,25.49 R2.2 | v30.4,27.66 29.49,28.57 A2.2 29.6,28.35 28.69,27.43 27.09,27.43 26.63,27.89 21.14,27.89 IC2.3
  Bottom 0.305: v34.18,26.29 31.77,26.29 v30.4,27.66
N$12
  Top 0.305: R26.1 34.18,28.57 32.12,30.63 25.95,30.63 24.92,31.66 21.14,31.66 IC2.6
N$13
  Top 0.381: LINK1.2 88.92,9.94 92.47,9.94 93.95,11.43 IN1.P2
N$14  (via drill 0.3)
  Top 0.305: v13.49,60.47 12.8,61.15 12.8,61.38 C17.1 | v14.86,60.35 14.86,61.04 15.2,61.38 R23.1 | 18.75,62.98 17.83,62.98 R24.2 | 18.75,62.98 20.23,61.49 R25.1 | v18.75,62.87 18.75,62.98 | v86.87,30.29 86.64,30.29 86.3,29.95 70.98,29.95 67.55,33.38 v59.32,33.38
  Bottom 0.305: v13.49,60.47 14.74,60.47 v14.86,60.35 16.23,60.35 | v18.75,62.87 16.23,60.35 | v86.87,30.29 87.1,30.52 88.12,30.52 U$4.TIP | v59.32,33.38 49.03,33.38 44.69,29.03 38.29,29.03 20.69,46.63 20.69,55.78 16.23,60.24 16.23,60.35
N$15
  Top 0.381: LINK2.2 88.92,15.54 92.35,15.54 93.95,17.14 IN2.P2
N$16  (via drill 0.3)
  Top 0.305: v43.2,60.24 43.2,61.38 R22.2 | v61.04,25.26 60.81,25.26 60.69,25.15 59.89,25.15 U10.5
  Bottom 0.305: v43.2,60.24 52.81,50.63 53.03,50.63 61.04,42.63 v61.04,25.26
N$17  (via drill 0.3)
  Top 0.305: v46.63,29.95 36.58,40.01 36.58,45.61 40.58,49.61 40.58,61.38 R20.2 | v58.52,26.18 58.98,25.72 59.78,25.72 U10.6
  Bottom 0.305: v46.63,29.95 54.75,29.95 v58.52,26.18
N$18  (via drill 0.3)
  Top 0.305: v39.66,61.38 38.18,61.38 R19.2 | v55.44,49.15 v55.44,50.98 | v61.84,25.38 60.92,26.29 59.89,26.29 U10.7
  Bottom 0.305: v39.66,61.38 45.03,61.38 v55.44,50.98 | v55.44,49.15 55.44,48.92 61.84,42.52 v61.84,25.38
N$19
  Top 0.381: IN3.P2 93.61,22.86 91.67,20.92 88.92,20.92 LINK3.2
N$20  (via drill 0.3)
  Top 0.305: v9.37,68.58 9.37,68.69 10.06,69.38 C1.2
  Bottom 0.305: v9.37,68.58 9.37,63.89 1.94,56.46 1.94,54.06 CN4.6
N$21
  Top 0.305: U1.8 43.89,43.2 39.43,43.2 X1.3
PIN1  (via drill 0.3)
  Top 0.305: v82.07,5.49 77.84,5.49 76.24,3.89 JP2.6
  Bottom 0.305: U8.1 79.21,48.81 79.21,45.61 84.24,40.58 84.24,20.12 82.41,18.29 82.41,18.17 82.07,17.83 v82.07,5.49
PIN2
  Bottom 0.305: U8.2 76.69,48.81 76.69,44.58 79.21,42.06 79.21,21.95 77.15,21.95 75.89,20.69 75.89,7.2 78.64,4.46 78.64,3.89 JP2.5
PIN5
  Bottom 0.305: U8.5 69.27,48.92 69.95,48.92 71.09,50.06 77.27,50.06 78.3,49.03 78.3,45.83 83.78,40.35 83.78,20.34 81.95,18.52 81.95,18.4 81.38,17.83 81.38,3.89 JP2.4
PIN7  (via drill 0.3)
  Top 0.305: v65.27,48.23 65.27,44.58 v70.87,38.98 | v72.92,36.92 82.75,36.92 96.13,23.55 96.13,8.23 93.61,5.71 85.72,5.71 JP2.3
  Bottom 0.305: v65.27,48.23 64.69,48.81 64.35,48.81 U8.7 | v72.92,36.92 v70.87,38.98
PIN8
  Bottom 0.305: U8.8 62.64,48.92 62.64,49.61 66.41,53.38 76.47,53.38 80.81,49.03 80.81,44.69 85.72,39.78 85.72,22.4 86.3,21.83 86.3,3.89 JP2.2
PIN9
  Bottom 0.305: U8.9 81.72,48.81 81.72,44.46 86.18,40.01 86.18,22.63 86.75,22.06 86.75,15.43 88.81,13.37 88.81,3.89 JP2.1
PROG  (via drill 0.3)
  Top 0.305: v16.34,67.78 17.72,67.78 R4.2 | v12.69,71.44 12,71.44 11.43,72.01 U2.5
  Bottom 0.305: v12.69,71.44 v16.34,67.78
PWR  (via drill 0.3)
  Top 0.381: Q1.2 16,72.47 17.6,72.47 18.75,73.61 D1.C 18.97,73.72 v21.83,73.72 | v27.32,60.24 27.89,60.81 27.89,61.38 R17.2 | C7.1 v22.86,64.58 | C2.1 30.4,69.38 v29.26,69.38 29.15,69.49 29.15,70.29 v28.46,70.98 | v28.46,73.84 27.55,74.75 27.32,74.75 U3.3 | U11.3 77.84,25.38 77.84,22.86 74.98,20 74.98,12.57 72.69,10.29 56.01,10.29 55.55,9.83 33.83,9.83 30.06,6.06 14.86,6.06 12.69,3.89 JP3.13 12.69,3.66 11.43,2.4 8.91,2.4 3.54,7.77 3.54,19.32 3.09,19.77 v3.09,36.23
  Bottom 0.381: v27.32,60.24 26.06,61.49 25.95,61.49 23.66,63.78 | 23.66,63.78 v22.86,64.58 22.75,64.69 15.66,64.69 12,61.04 12,56.35 3.09,47.43 2.97,47.43 1.94,46.41 CN4.3 2.06,46.29 3.31,45.03 3.31,36.46 v3.09,36.23 | 23.66,63.78 v29.26,69.38 | v28.46,70.98 v28.46,73.84 28.35,73.72 v21.83,73.72
RST  (via drill 0.3)
  Top 0.305: C1.1 10.06,67.67 10.06,66.86 9.37,66.18 9.37,62.52 9.72,62.18 10.74,62.18 11.89,61.04 11.89,60.69 13.72,58.86 22.86,58.86 25.38,61.38 R1.2 25.49,61.49 v26.29,62.29 | 47.89,51.55 47.89,50.29 U1.29 | 47.89,51.55 50.29,53.95 64.47,53.95 69.15,49.26 69.15,43.66 72.35,40.46 75.55,40.46 76.58,39.43 77.5,39.43 ICSP1.5 | v47.78,51.55 47.89,51.55
  Bottom 0.305: v26.29,62.29 35.09,62.29 44.92,52.46 46.86,52.46 v47.78,51.55
STAT
  Top 0.305: LED1.MINUS 10.06,61.49 9.72,61.49 8.69,62.52 8.69,75.21 10.17,76.69 10.74,76.69 11.32,76.12 11.32,74.64 U2.1
VBAT  (via drill 0.3)
  Top 0.305: U2.3 9.6,74.52 9.6,73.95 9.94,73.61 11.77,73.61 12.69,74.52 14.97,74.52 Q1.3 15.09,74.64 17.6,74.64 v17.83,74.87
  Bottom 0.305: v17.83,74.87 16.69,73.72 CN3.1
VBUS  (via drill 0.3)
  Top 0.381: CN1.VBUS 7.66,15.66 7.66,16.12 8.69,17.14 8.69,21.83 5.14,25.38 IN5.P1 | D1.A 23.09,73.61 20.92,71.44 15.43,71.44 14.52,72.35 14.17,72.35 Q1.1 13.95,72.35 v12.34,72.35 | 18.86,66.75 19.32,66.75 20.23,67.67 R5.2 | 18.86,66.75 16.23,66.75 15.32,67.67 R3.1 15.32,67.44 v14.06,66.18 | v12,66.18 12.69,66.86 12.69,67.67 C6.1 | v9.6,70.52 9.6,72.01 U2.4 | 18.86,66.75 v18.86,63.89
  Bottom 0.381: v14.06,66.18 v12,66.18 11.89,66.29 11.32,66.29 11.09,66.52 11.09,68.01 9.6,69.49 v9.6,70.52 11.43,72.35 v12.34,72.35 | v18.86,63.89 15.77,63.89 12.69,60.81 12.69,56.12 5.26,48.69 5.26,42.29 7.09,40.46 7.09,34.75 5.14,32.8 5.14,25.49 IN5.P1
VCC
  Bottom 0.305: U$2.VDD 92.58,51.66 93.73,52.81 93.73,56.35 92.58,57.49 U$2.A+

### Text on the board
tNames: Charging | ST7565 LCD Node / Richard Hawthorn / richardhawthorn.com | ANT | GRN | FTDI | BLK | Vin | + | - | gnd vcc | IN3 | gnd vcc | IN2 | gnd vcc | IN1 | RH012.1 / Mar 2015 | GND | VIN | 3.3 | 0 | 1 | 2 | 3 | 4 | 5 | 6 | 7 | 8 | 9 | 10 | 11 | 12 | 13 | A0 | A1 | A2 | A3 | A4 | A5 | A6 | A7 | 1 | 2 | 5 | 7 | 8 | 9 | RX | TX | ~ | ~ | ~ | ~ | SS | MO | MI | SK | SDA | SCL | Imp
tDocu: REG